# EAGLE design SiNEProduction (EAGLE 6.1)
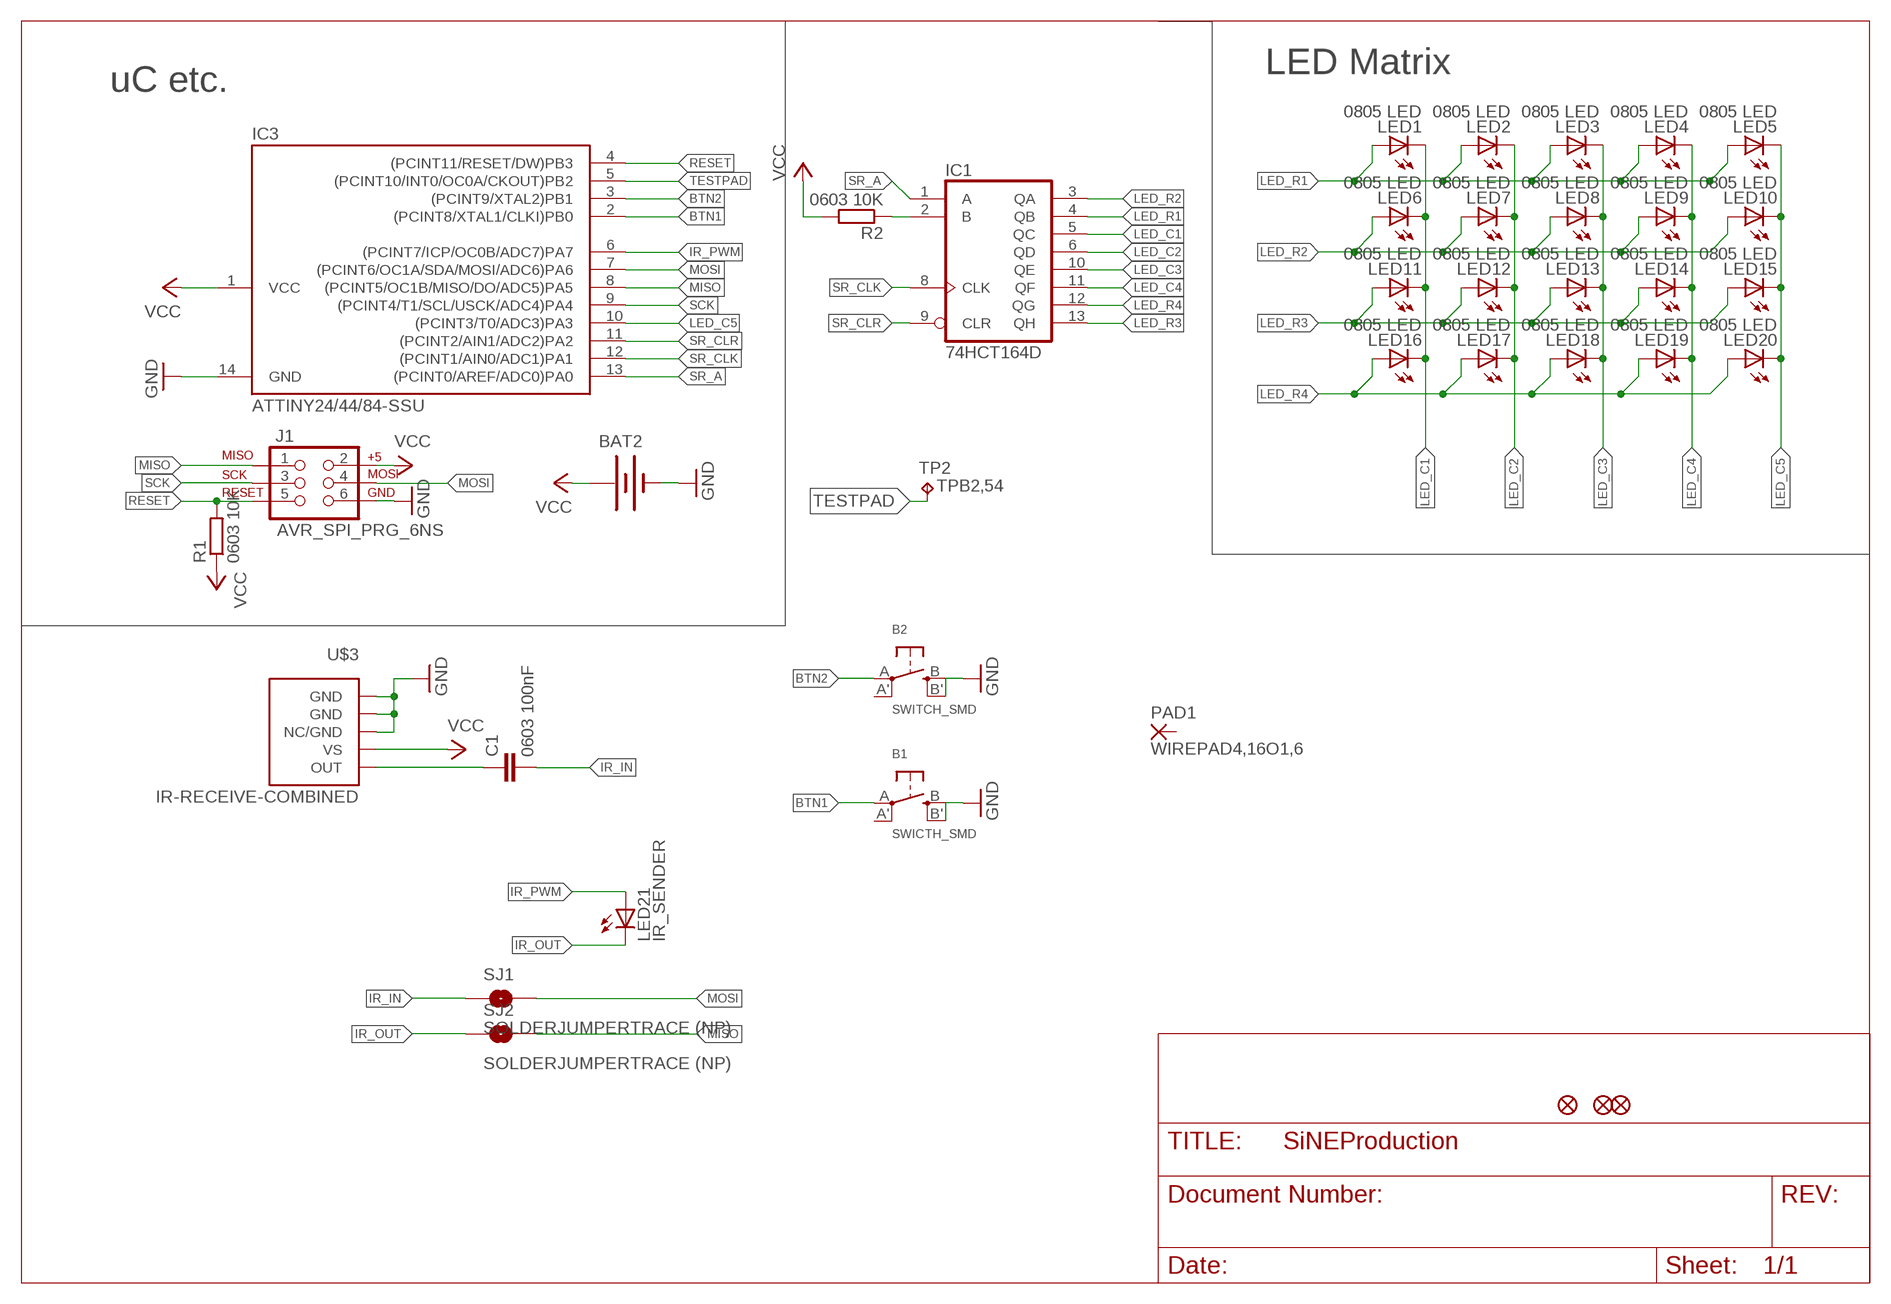
[diagram p0: schematic, sheet 1]

## Parts
B1  SWICTH_SMD  SWITCH_TACT_SMT  [EVQ-Q2]
B2  SWITCH_SMD  SWITCH_TACT_SMT  [EVQ-Q2]
BAT2  BATTERY20SMD  [BATTCON_20MM]
C1  0603 100nF  C-EUC0805  [C0805]
IC1  74HCT164D  [SO14]
IC3  ATTINY24/44/84-SSU  [SOIC14]
J1  AVR_SPI_PRG_6NS  [2X3-NS]
JP1  FIDUCIAL1X2.5-STOP  [FIDUCIAL-1X2.5-STOP]
JP2  FIDUCIAL1X2.5-STOP  [FIDUCIAL-1X2.5-STOP]
JP3  FIDUCIAL1X2.5-STOP  [FIDUCIAL-1X2.5-STOP]
LED1  0805 LED  LEDCHIPLED_0805  [CHIPLED_0805]
LED2  0805 LED  LEDCHIPLED_0805  [CHIPLED_0805]
LED3  0805 LED  LEDCHIPLED_0805  [CHIPLED_0805]
LED4  0805 LED  LEDCHIPLED_0805  [CHIPLED_0805]
LED5  0805 LED  LEDCHIPLED_0805  [CHIPLED_0805]
LED6  0805 LED  LEDCHIPLED_0805  [CHIPLED_0805]
LED7  0805 LED  LEDCHIPLED_0805  [CHIPLED_0805]
LED8  0805 LED  LEDCHIPLED_0805  [CHIPLED_0805]
LED9  0805 LED  LEDCHIPLED_0805  [CHIPLED_0805]
LED10  0805 LED  LEDCHIPLED_0805  [CHIPLED_0805]
LED11  0805 LED  LEDCHIPLED_0805  [CHIPLED_0805]
LED12  0805 LED  LEDCHIPLED_0805  [CHIPLED_0805]
LED13  0805 LED  LEDCHIPLED_0805  [CHIPLED_0805]
LED14  0805 LED  LEDCHIPLED_0805  [CHIPLED_0805]
LED15  0805 LED  LEDCHIPLED_0805  [CHIPLED_0805]
LED16  0805 LED  LEDCHIPLED_0805  [CHIPLED_0805]
LED17  0805 LED  LEDCHIPLED_0805  [CHIPLED_0805]
LED18  0805 LED  LEDCHIPLED_0805  [CHIPLED_0805]
LED19  0805 LED  LEDCHIPLED_0805  [CHIPLED_0805]
LED20  0805 LED  LEDCHIPLED_0805  [CHIPLED_0805]
LED21  IR_SENDER  LEDCHIPLED_1206  [CHIPLED_1206]
PAD1  WIREPAD4,16O1,6  [4,16O1,6]
R1  0603 10K  R-EU_R0805  [R0805]
R2  0603 10K  R-EU_R0805  [R0805]
SJ1  SOLDERJUMPERTRACE (NP)  SOLDERJUMPERTRACE  [SJ_2S-TRACE]
SJ2  SOLDERJUMPERTRACE (NP)  SOLDERJUMPERTRACE  [SJ_2S-TRACE]
TP2  TPB2,54  [B2,54]
U$3  IR-RECEIVE-COMBINED  [TSOP-COMBINED]

## Nets
BTN1: B1.A(P) IC3.2((PCINT8/XTAL1/CLKI)PB0)
BTN2: B2.A(P) IC3.3((PCINT9/XTAL2)PB1)
GND: B1.B'(S1) B1.B(S) B2.B'(S1) B2.B(S) BAT2.2(-) IC3.14(GND) J1.6 U$3.1(GND) U$3.2(NC/GND) U$3.5(GND)
IR_IN: C1.2 SJ1.1
IR_OUT: LED21.C SJ2.1
IR_PWM: IC3.6((PCINT7/ICP/OC0B/ADC7)PA7) LED21.A
LED_C1: IC1.5(QC) LED1.C LED6.C LED11.C LED16.C
LED_C2: IC1.6(QD) LED2.C LED7.C LED12.C LED17.C
LED_C3: IC1.10(QE) LED3.C LED8.C LED13.C LED18.C
LED_C4: IC1.11(QF) LED4.C LED9.C LED14.C LED19.C
LED_C5: IC3.10((PCINT3/T0/ADC3)PA3) LED5.C LED10.C LED15.C LED20.C
LED_R1: IC1.4(QB) LED1.A LED2.A LED3.A LED4.A LED5.A
LED_R2: IC1.3(QA) LED6.A LED7.A LED8.A LED9.A LED10.A
LED_R3: IC1.13(QH) LED11.A LED12.A LED13.A LED14.A LED15.A
LED_R4: IC1.12(QG) LED16.A LED17.A LED18.A LED19.A LED20.A
MISO: IC3.8((PCINT5/OC1B/MISO/DO/ADC5)PA5) J1.1 SJ2.2
MOSI: IC3.7((PCINT6/OC1A/SDA/MOSI/ADC6)PA6) J1.4 SJ1.2
N$1: IC1.2(B) R2.1
N$6: C1.1 U$3.4(OUT)
RESET: IC3.4((PCINT11/RESET/DW)PB3) J1.5 R1.2
SCK: IC3.9((PCINT4/T1/SCL/USCK/ADC4)PA4) J1.3
SR_A: IC1.1(A) IC3.13((PCINT0/AREF/ADC0)PA0)
SR_CLK: IC1.8(CLK) IC3.12((PCINT1/AIN0/ADC1)PA1)
SR_CLR: IC1.9(CLR) IC3.11((PCINT2/AIN1/ADC2)PA2)
TESTPAD: IC3.5((PCINT10/INT0/OC0A/CKOUT)PB2) TP2.TP
VCC: BAT2.1(+) IC3.1(VCC) J1.2 R1.1 R2.2 U$3.3(VS)
Unconnected: B1.A'(P1) B2.A'(P1) PAD1.1(P)

## Notes on the sheet
- LED Matrix
- uC etc.

## Power pins joined to a net without a drawn wire
GND: IC1.7(GND)
VCC: IC1.14(VCC)

## Library data of the parts
B1 B2 = microbuilder:SWITCH_TACT_SMT: SMT Tact Switches 6x6mm - Digikey: P12940SCT-ND KMR2 (4.6x2.8mm) - Digikey: 401-1426-1-ND EVQ-PQHB55 - Light Touch, 160GF (4.5x4.5mm) - Digikey: P8090SCT-ND
BAT2 = SiNE Parts:BATTERY: Battery Holders Various common sizes : AA, AAA, 20mm coin cell and 12mm coin cell.
C1 = rcl:C-EU: CAPACITOR, European symbol
IC1 = SiNE Parts:74*164: 8-bit parallel out SHIFT REGISTER
IC3 = SiNE Parts:ATTINY24/44/84
J1 = AVR Header:AVR_SPI_PRG_6: AVR ISP 6 Pin This is the reduced ISP connector for AVR programming. Common on Arduino. This footprint will take up less PCB space and can be used with a 10-pin to 6-pin adapter such as SKU: BOB-08508
JP1-JP3 = CISECO eaglecad designs:FIDUCIAL: Fiducial Alignment Points Various fiducial points for machine vision alignment.
LED1-LED20 = adafruit:LED: LED
LED21 = led:LED: LED
PAD1 = wirepad:WIREPAD: Wire PAD connect wire on PCB
R1 R2 = rcl:R-EU_: RESISTOR, European symbol
SJ1 SJ2 = SparkFun:SOLDERJUMPER: Solder Jumper Standard SMD solder jumper. Used to automate production. Two varients : Normally Open and Normally Closed are the same, but have different paste layers. NC will have a large amount of paste and should jumper during reflow.
TP2 = SiNE Parts:TP: Test pad
U$3 = SiNE Parts:IR-RECEIVE-COMBINED

## Board
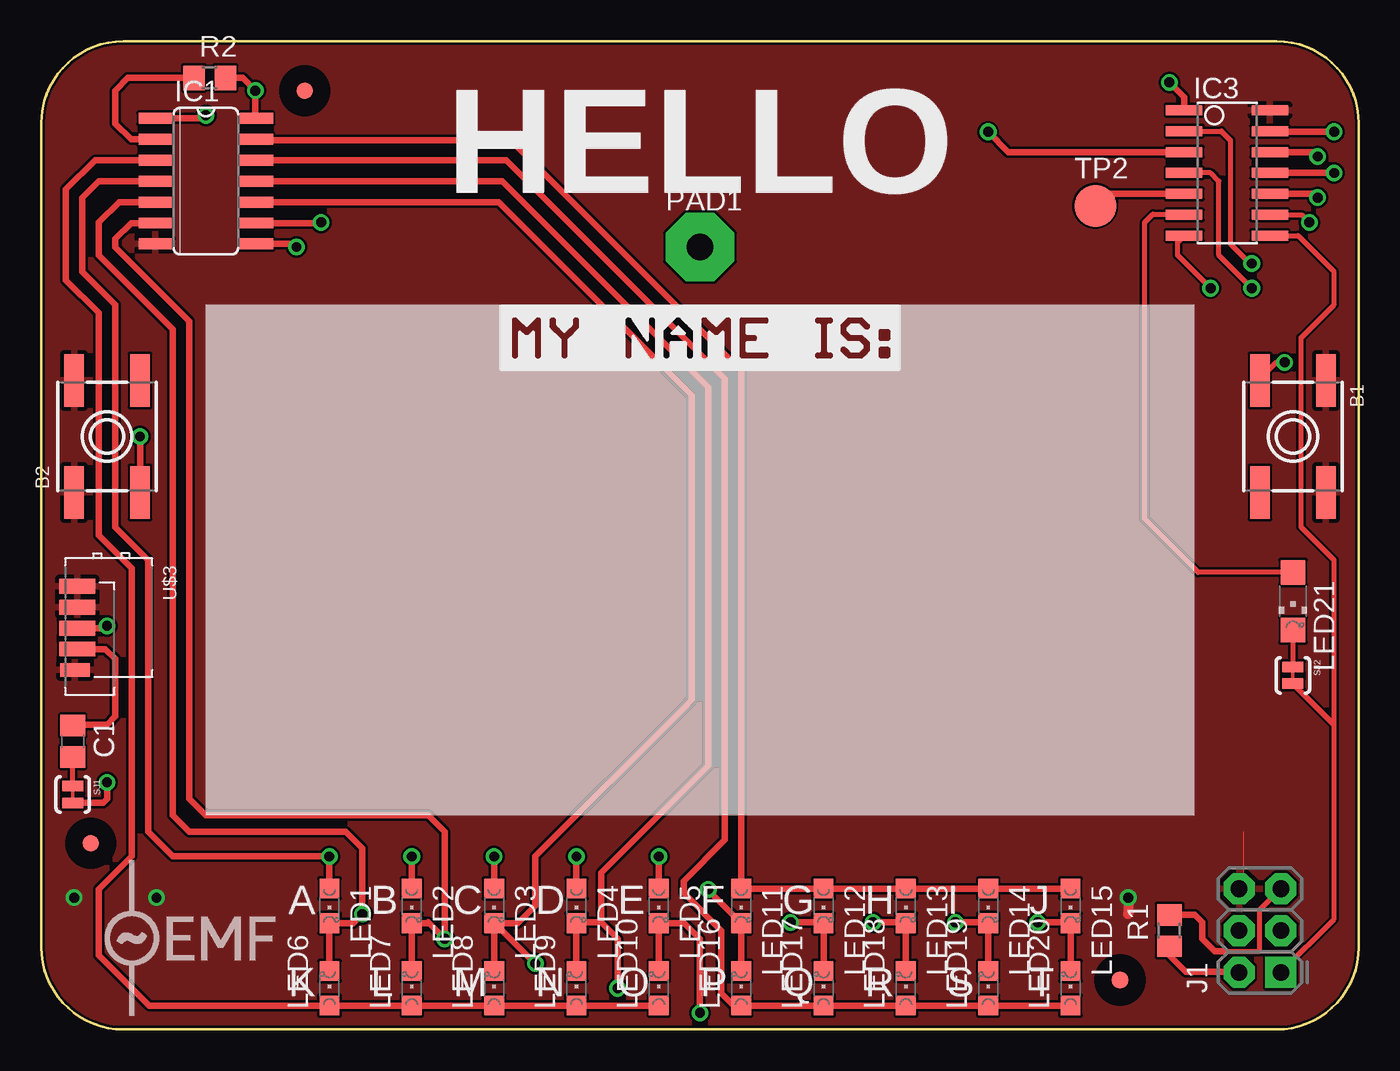
[diagram p1: board, top side]
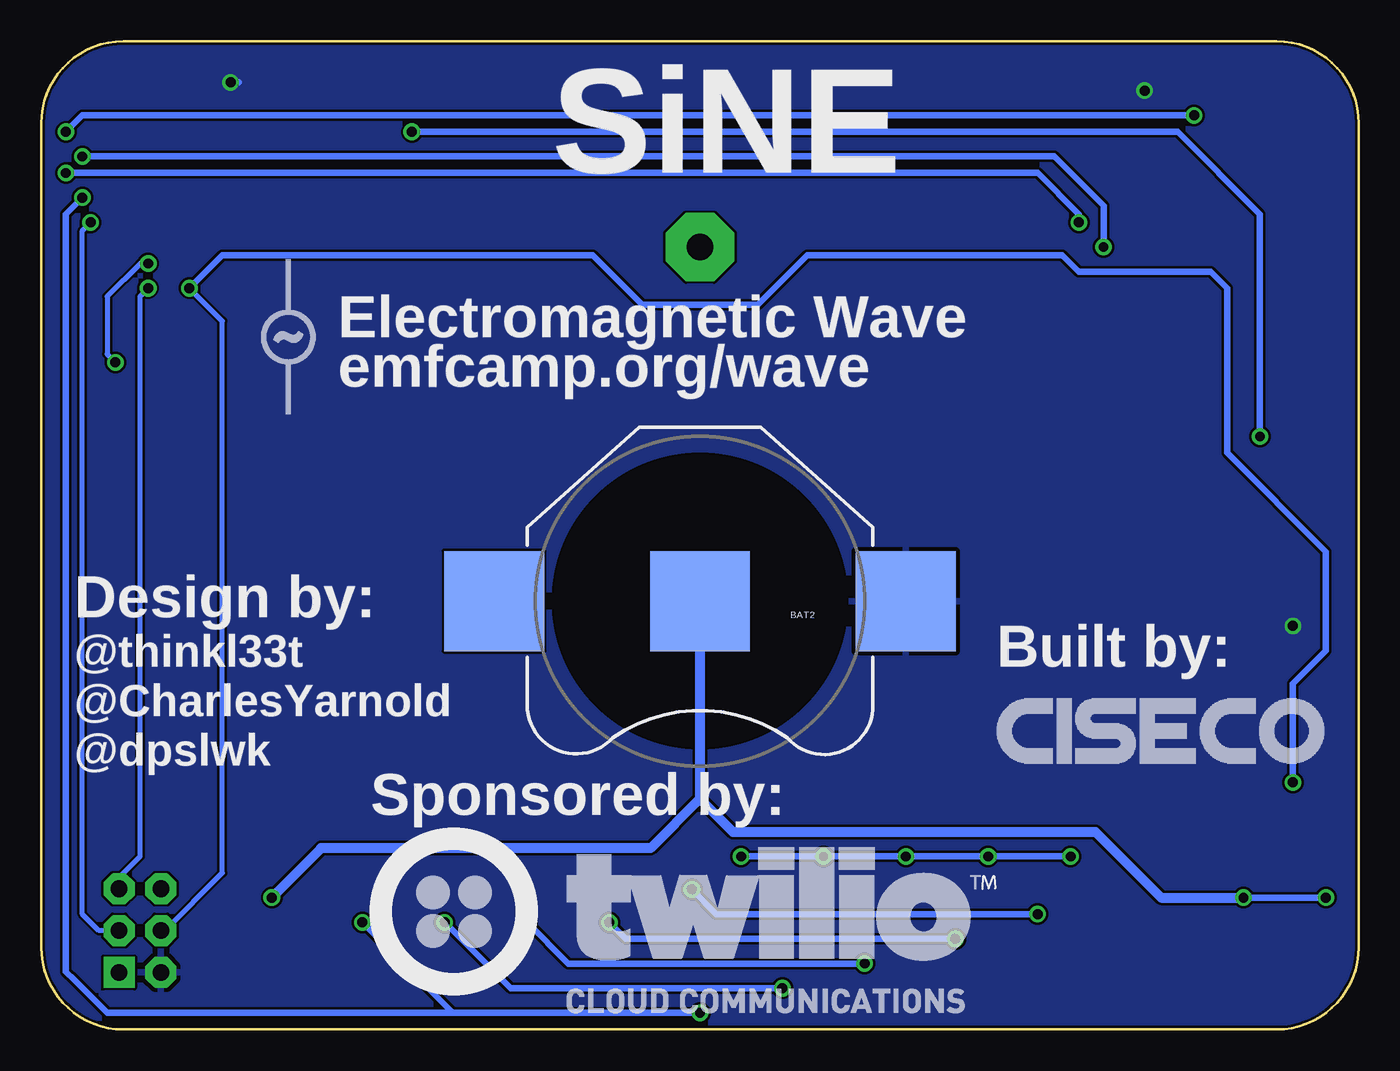
[diagram p2: board, bottom side, seen from below]

Size 80 x 60 mm. Coordinates in mm from the lower left corner, seen from the top.
Outline: 80,55 80,5 arc-90 75,0 5,0 arc-90 0,5 0,55 arc-90 5,60 75,60 arc-90 80,55
Copper layers (1*16): Top 0.035mm / dielectric 1mm / Bottom 0.035mm
Design rules: minimum track width 0.15mm, minimum drill 0.3mm, track to track 0.15mm, track to pad 0.15mm, pad to pad 0.15mm, via to via 0.15mm, smd to smd 0mil, copper to edge 0.15mm, drill to drill 0.15mm, minimum pad ring 10mil, minimum via ring 8mil, stop-mask expansion 4mil, vias tented up to drill 0.61mm, thermal gap 10mil
bRestrict: area 31,17 to 49,35

### Footprints (pad centres in the part's own frame; a part is rotated, then mirrored left to right if it is on the bottom)
EVQ-Q2 = smd 3.2 x 1.2: A -3.4,-2; A' 3.4,-2; B -3.4,2; B' 3.4,2
BATTCON_20MM = smd 6.07 x 6.07: 1 -12.5,0; 2 0,0; 3 12.5,0
C0805 = smd 1.3 x 1.5: 1 -0.95,0; 2 0.95,0
SO14 = smd 0.66 x 2.032: 1 -3.81,-3.073; 2 -2.54,-3.073; 3 -1.27,-3.073; 4 0,-3.073; 5 1.27,-3.073; 6 2.54,-3.073; 7 3.81,-3.073; 8 3.81,3.073; 9 2.54,3.073; 10 1.27,3.073; 11 0,3.073; 12 -1.27,3.073; 13 -2.54,3.073; 14 -3.81,3.073
SOIC14 = smd 0.61 x 2.21: 1 -3.81,-2.603; 2 -2.54,-2.603; 3 -1.27,-2.603; 4 0,-2.603; 5 1.27,-2.603; 6 2.54,-2.603; 7 3.81,-2.603; 8 3.81,2.603; 9 2.54,2.603; 10 1.27,2.603; 11 0,2.603; 12 -1.27,2.603; 13 -2.54,2.603; 14 -3.81,2.603
2X3-NS = drill 1.016 pad 1.88 square: 1 -2.54,-1.27 | drill 1.016 pad 1.88 octagon: 2 -2.54,1.27; 3 0,-1.27; 4 0,1.27; 5 2.54,-1.27; 6 2.54,1.27
FIDUCIAL-1X2.5-STOP = smd 1 x 1: 1 0,0
CHIPLED_0805 = smd 1.2 x 1.2: A 0,-1.05; C 0,1.05
CHIPLED_1206 = smd 1.5 x 1.5: A 0,-1.75; C 0,1.75
4,16O1,6 = drill 1.6 pad 4.166 octagon: 1 0,0
R0805 = smd 1.3 x 1.5: 1 -0.95,0; 2 0.95,0
SJ_2S-TRACE = smd 0.635 x 1.27: 1 -0.508,0; 2 0.508,0
B2,54 = smd 2.54 x 2.54: TP 0,0
TSOP-COMBINED = smd 0.9 x 2.2: 1 -1.905,-2.055; 2 -0.635,-2.055; 3 0.635,-2.055; 4 1.905,-2.055 | smd 0.8 x 1.8: 5 3.175,-2.2

### Placement (x,y rotation side)
B1  76,36 270 top
B2  4,36 90 top
BAT2  40,26 180 bottom
C1  1.92,17.5 270 top
IC1  10,51.5 270 top
IC3  72,52 270 top
J1  74,6 90 top
JP1  65.5,3 0 top
JP2  16,57 0 top
JP3  3,11.3 0 top
LED1  17.5,7.5 180 top
LED2  22.5,7.5 180 top
LED3  27.5,7.5 180 top
LED4  32.5,7.5 180 top
LED5  37.5,7.5 180 top
LED6  17.5,2.5 0 top
LED7  22.5,2.5 0 top
LED8  27.5,2.5 0 top
LED9  32.5,2.5 0 top
LED10  37.5,2.5 0 top
LED11  42.5,7.5 180 top
LED12  47.5,7.5 180 top
LED13  52.5,7.5 180 top
LED14  57.5,7.5 180 top
LED15  62.5,7.5 180 top
LED16  42.5,2.5 0 top
LED17  47.5,2.5 0 top
LED18  52.5,2.5 0 top
LED19  57.5,2.5 0 top
LED20  62.5,2.5 0 top
LED21  76,26 180 top
PAD1  40,47.5 0 top
R1  68.5,6 90 top
R2  10.23,57.77 0 top
SJ1  1.92,14.27 270 top
SJ2  76,21.5 270 top
TP2  64,50 0 top
U$1  [TWILIO]  60,1 0 bottom
U$2  [EMFLOGO1]  65,42 0 bottom
U$3  4.25,25 270 top
U$4  [NAME]  40,42 0 top
U$5  [CISECO1]  22,15 0 bottom
U$6  [EMFLOGO]  5.5,5.5 0 top

### Tracks (layer width: path | path; a pad name or v marks a point on that pad's centre or on a via)
BTN1  (via drill 0.6)
  Top 0.305: IC3.2 71.66,54.54 72.2,54 72.2,47.7 73.4,46.5 v73.5,46.5 | v75.5,40.5 75,40.5 74,39.5 B1.A
  Bottom 0.305: v73.5,46.5 74,46.5 76,44.5 76,41 v75.5,40.5
BTN2  (via drill 0.6)
  Top 0.406: B2.A v6,36 | IC3.3 58.73,53.27 v57.5,54.5
  Bottom 0.406: v6,36 6,49.5 11,54.5 v57.5,54.5
GND  (via drill 0.6)
  Top 0: J1.6 73,8.81 73,12
  Top 0.61: v66,8 66,7
  Bottom 0.406: v2,8 v7,8
  Bottom 0.61: 40,14 38,12 16,12 12,8 v7,8 | BAT2.2 40,14 | 40,14 43,11 63,11 v66,8
  pour Top: 0,0 80,0 80,60 0,60
IR_IN
  Top 0.305: SJ1.1 C1.2
IR_OUT
  Top 0.305: LED21.C SJ2.1
IR_PWM
  Top 0.305: LED21.A 70.25,27.75 67,31 67,49 67.5,49.5 69.36,49.5 IC3.6
LED_C1  (via drill 0.6)
  Top 0.406: LED16.C LED11.C 40.5,8.45 v40.5,8.5 | LED6.C LED1.C 18.95,6.45 v19.5,7 19.5,11 18.5,12 9,12 8,13 8,42.5 4,46.5 3.5,47 3.5,49 4.73,50.23 IC1.5
  Bottom 0.406: v19.5,7 35.5,7 39,7 v40.5,8.5
LED_C2  (via drill 0.6)
  Top 0.406: LED17.C LED12.C 47.45,6.5 v45.5,6.5 | LED7.C LED2.C | LED2.C 23.55,6.45 v24.5,5.5 24.5,12 23.5,13 10,13 9,14 9,43 4.5,47.5 4.5,48 5.46,48.96 IC1.6 | LED2.C 23.45,6.45 23.5,6.5
  Bottom 0.406: v24.5,5.5 44.5,5.5 v45.5,6.5
LED_C3  (via drill 0.6)
  Top 0.406: LED18.C LED13.C 52.45,6.5 v50.5,6.5 | LED8.C LED3.C | LED3.C 27.55,6.45 v30,4 | LED3.C 28.95,6.45 30,7.5 30,10.5 39,19.5 39.5,20 39.5,38 39.5,38.5 39,39 28,50 27.77,50.23 IC1.10
  Bottom 0.406: v30,4 48,4 v50.5,6.5
LED_C4  (via drill 0.6)
  Top 0.406: LED19.C LED14.C 57.45,6.5 v55.5,6.5 | LED9.C LED4.C 32.55,6.5 34,6.5 | 34,6.5 35,5.5 v35,2.5 | 34,6.5 34,9.5 40.5,16 40.5,39 28,51.5 IC1.11
  Bottom 0.406: v35,2.5 51.5,2.5 v55.5,6.5
LED_C5  (via drill 0.6)
  Top 0.406: LED20.C LED15.C 62.45,6.5 v60.5,6.5 | LED10.C LED5.C 39.05,6.45 39.5,6 40,5.5 v40,1 | IC3.10 77.27,50.73 v77.5,50.5
  Bottom 0.406: v40,1 55,1 | 55,1 v60.5,6.5 | 55,1 74.5,1 76,1 78,3 78.5,3.5 78.5,5 78.5,49.5 78,50 | 78,50 v77.5,50.5 78,50
LED_R1  (via drill 0.6)
  Top 0.406: LED5.A v37.5,10.5 | LED4.A v32.5,10.5 | LED3.A v27.5,10.5 | LED2.A v22.5,10.5 | LED1.A v17.5,10.5 8,10.5 6.5,12 6.5,28.5 4.5,30.5 4.5,44 2.5,46 2.5,50.5 3.5,51.5 IC1.4
  Bottom 0.406: v17.5,10.5 v22.5,10.5 v27.5,10.5 v32.5,10.5 v37.5,10.5
LED_R2
  Top 0.406: LED10.A LED9.A LED8.A LED7.A LED6.A 6.55,1.45 3.5,4.5 3.5,8.5 5.5,10.5 5.5,28 3.5,30 3.5,43.5 1.5,45.5 1.5,51 3.27,52.77 IC1.3
LED_R3
  Top 0.406: LED15.A LED14.A LED13.A LED12.A LED11.A 42.5,40 28.5,54 13.11,54 IC1.13
LED_R4
  Top 0.406: LED20.A LED19.A LED18.A LED17.A LED16.A 42.05,1.45 41.3,2.2 41.3,6 39,8.3 39,9 41.5,11.5 41.5,39.5 28.23,52.77 IC1.12
MISO
  Top 0.305: J1.1 78.5,6.69 78.5,18.5 | 78.5,18.5 77.01,19.99 SJ2.2 78.49,18.5 78.5,18.5 | 78.5,18.5 78.5,28.5 76.5,30.5 76.5,42 78.5,44 78.5,46 76.31,48.19 IC3.8
MOSI  (via drill 0.6)
  Top 0.305: 69.5,48.09 IC3.7 69,47.79 69,47 v71,45
  Top 0.406: SJ1.2 3.76,13.76 4,14 v4,15
  Bottom 0.305: J1.4 72.5,6 69,9.5 69,43 v71,45
  Bottom 0.406: v4,15 4,21 2,23 2,29 8,35 8,45 9,46 17,46 18,47 33.5,47 36.5,44 43.5,44 46.5,47 69,47 v71,45
N$1
  Top 0.406: IC1.2 5.46,54.04 4.5,55 4.5,57 5.27,57.77 R2.1
N$6
  Top 0.406: U$3.4 3.9,23.09 4.5,22.5 4.5,19 4,18.5 1.97,18.5 C1.1
RESET  (via drill 0.6)
  Top 0.305: 71.75,4.75 74,4.75 74,7.27 J1.5 | v73.5,45 71.5,47 71.5,51.5 71,52 IC3.4
  Top 0.406: R1.2 70.05,6.95 70.5,6.5 70.5,5.5 71.25,4.75 71.75,4.75
  Bottom 0.305: J1.5 75.27,9.23 74,10.5 74,44.5 v73.5,45
SCK  (via drill 0.6)
  Top 0.305: IC3.9 76.54,49.46 v77,49
  Bottom 0.305: J1.3 76.5,6 77.5,7 77.5,48.5 v77,49
SR_A  (via drill 0.6)
  Top 0.406: IC1.1 9.81,55.31 v10,55.5 | v78.5,54.5 75.5,54.5 75.56,54.5 IC3.13
  Bottom 0.406: v10,55.5 77.5,55.5 v78.5,54.5
SR_CLK  (via drill 0.6)
  Top 0.406: IC1.8 15.31,47.69 v15.5,47.5 | IC3.12 77.23,53.27 v77.5,53
  Bottom 0.406: v15.5,47.5 15.5,50 18.5,53 v77.5,53
SR_CLR  (via drill 0.6)
  Top 0.406: IC1.9 16.96,48.96 v17,49 | v78.5,52 IC3.11
  Bottom 0.406: v17,49 17,49.5 19.5,52 v78.5,52
TESTPAD
  Top 0.406: IC3.5 64.73,50.73 TP2.TP
VCC  (via drill 0.6)
  Top 0.406: R2.2 12.23,57.77 v13,57 13,55.38 IC1.14 | IC3.1 69.4,56.6 v68.5,57.5 | R1.1 68.5,4.5 69.5,3.5 72.69,3.5 J1.2 | U$3.3 4,24.36 v4,24.5
  Bottom 0.406: v68.5,57.5 68,57.5
  pour Bottom: 0,0 80,0 80,60 0,60

### Text on the board
tPlace: HELLO | A | B | C | D | E | F | G | H | I | J | K | L | M | N | O | P | Q | R | S | T
bPlace: SiNE | Electromagnetic Wave | emfcamp.org/wave | Design by: | Built by: | @thinkl33t | @CharlesYarnold | @dpslwk | Sponsored by: